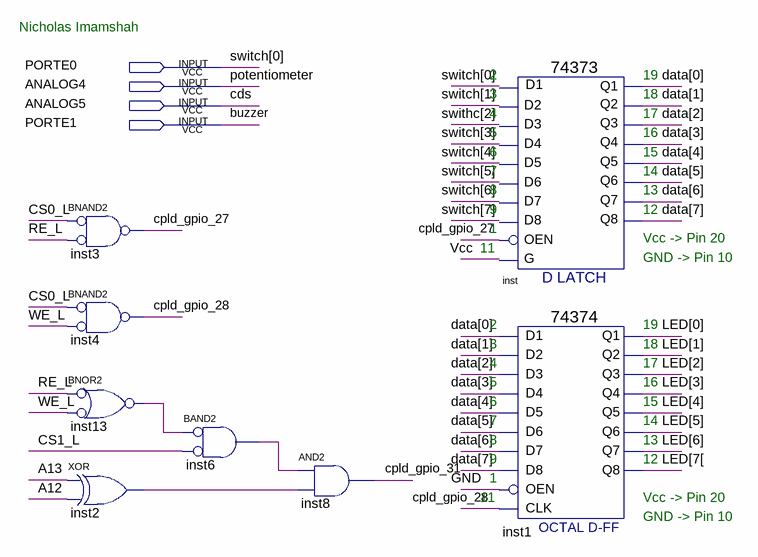
[diagram p0: schematic sheet]
// Quartus schematic Schematics.bdf as structural Verilog: 8 symbols, 4 pins
module Schematics (
  input  PORTE0,
  input  ANALOG4,
  input  ANALOG5,
  input  PORTE1
);

  wire A12, A13, cpld_gpio_27, cpld_gpio_28, cpld_gpio_31, CS0_L, CS1_L, GND, inst2_out, inst6_out,
       inst13_out, \LED[7[ , RE_L, Vcc, WE_L;
  wire [2:2] swithc;
  wire [6:0] LED;
  wire [7:0] data;
  wire [7:1] switch;

  nand inst3 (cpld_gpio_27, ~CS0_L, ~RE_L);  // BNAND2
  nand inst4 (cpld_gpio_28, ~CS0_L, ~WE_L);  // BNAND2
  nor inst13 (inst13_out, ~RE_L, ~WE_L);  // BNOR2
  xor inst2 (inst2_out, A13, A12);
  and inst6 (inst6_out, ~inst13_out, ~CS1_L);  // BAND2
  and inst8 (cpld_gpio_31, inst6_out, inst2_out);
  \74373  inst (
    .D1(PORTE0), .D3(swithc[2]), .D6(switch[5]), .D7(switch[6]), .D2(switch[1]), .G(Vcc), .D4(switch[3]),
    .D5(switch[4]), .D8(switch[7]), .OEN(cpld_gpio_27), .Q3(data[2]), .Q6(data[5]), .Q7(data[6]),
    .Q2(data[1]), .Q8(data[7]), .Q4(data[3]), .Q5(data[4]), .Q1(data[0]));
  \74374  inst1 (
    .D1(data[0]), .D2(data[1]), .D3(data[2]), .D4(data[3]), .D6(data[5]), .D5(data[4]), .OEN(GND),
    .D8(data[7]), .D7(data[6]), .CLK(cpld_gpio_28), .Q2(LED[1]), .Q3(LED[2]), .Q5(LED[4]), .Q4(LED[3]),
    .Q6(LED[5]), .Q7(LED[6]), .Q8(\LED[7[ ), .Q1(LED[0]));

  // Other names for the same wires on the sheet: buzzer = PORTE1; cds = ANALOG5; potentiometer = ANALOG4;
  //   switch[0] = PORTE0

  // Notes on the sheet:
  //   Nicholas Imamshah
  //   2
  //   19
  //   3
  //   18
  //   4
  //   17
  //   5
  //   16
  //   6
  //   15
  //   7
  //   14
  //   8
  //   13
  //   9
  //   12
  //   1
  //   Vcc -> Pin 20
  //   11
  //   GND -> Pin 10
  //   2
  //   19
  //   3
  //   18
  //   4
  //   17
  //   5
  //   16
  //   6
  //   15
  //   7
  //   14
  //   8
  //   13
  //   9
  //   12
  //   1
  //   11
  //   Vcc -> Pin 20
  //   GND -> Pin 10
endmodule
